# EAGLE design io_module (EAGLE 6.3)
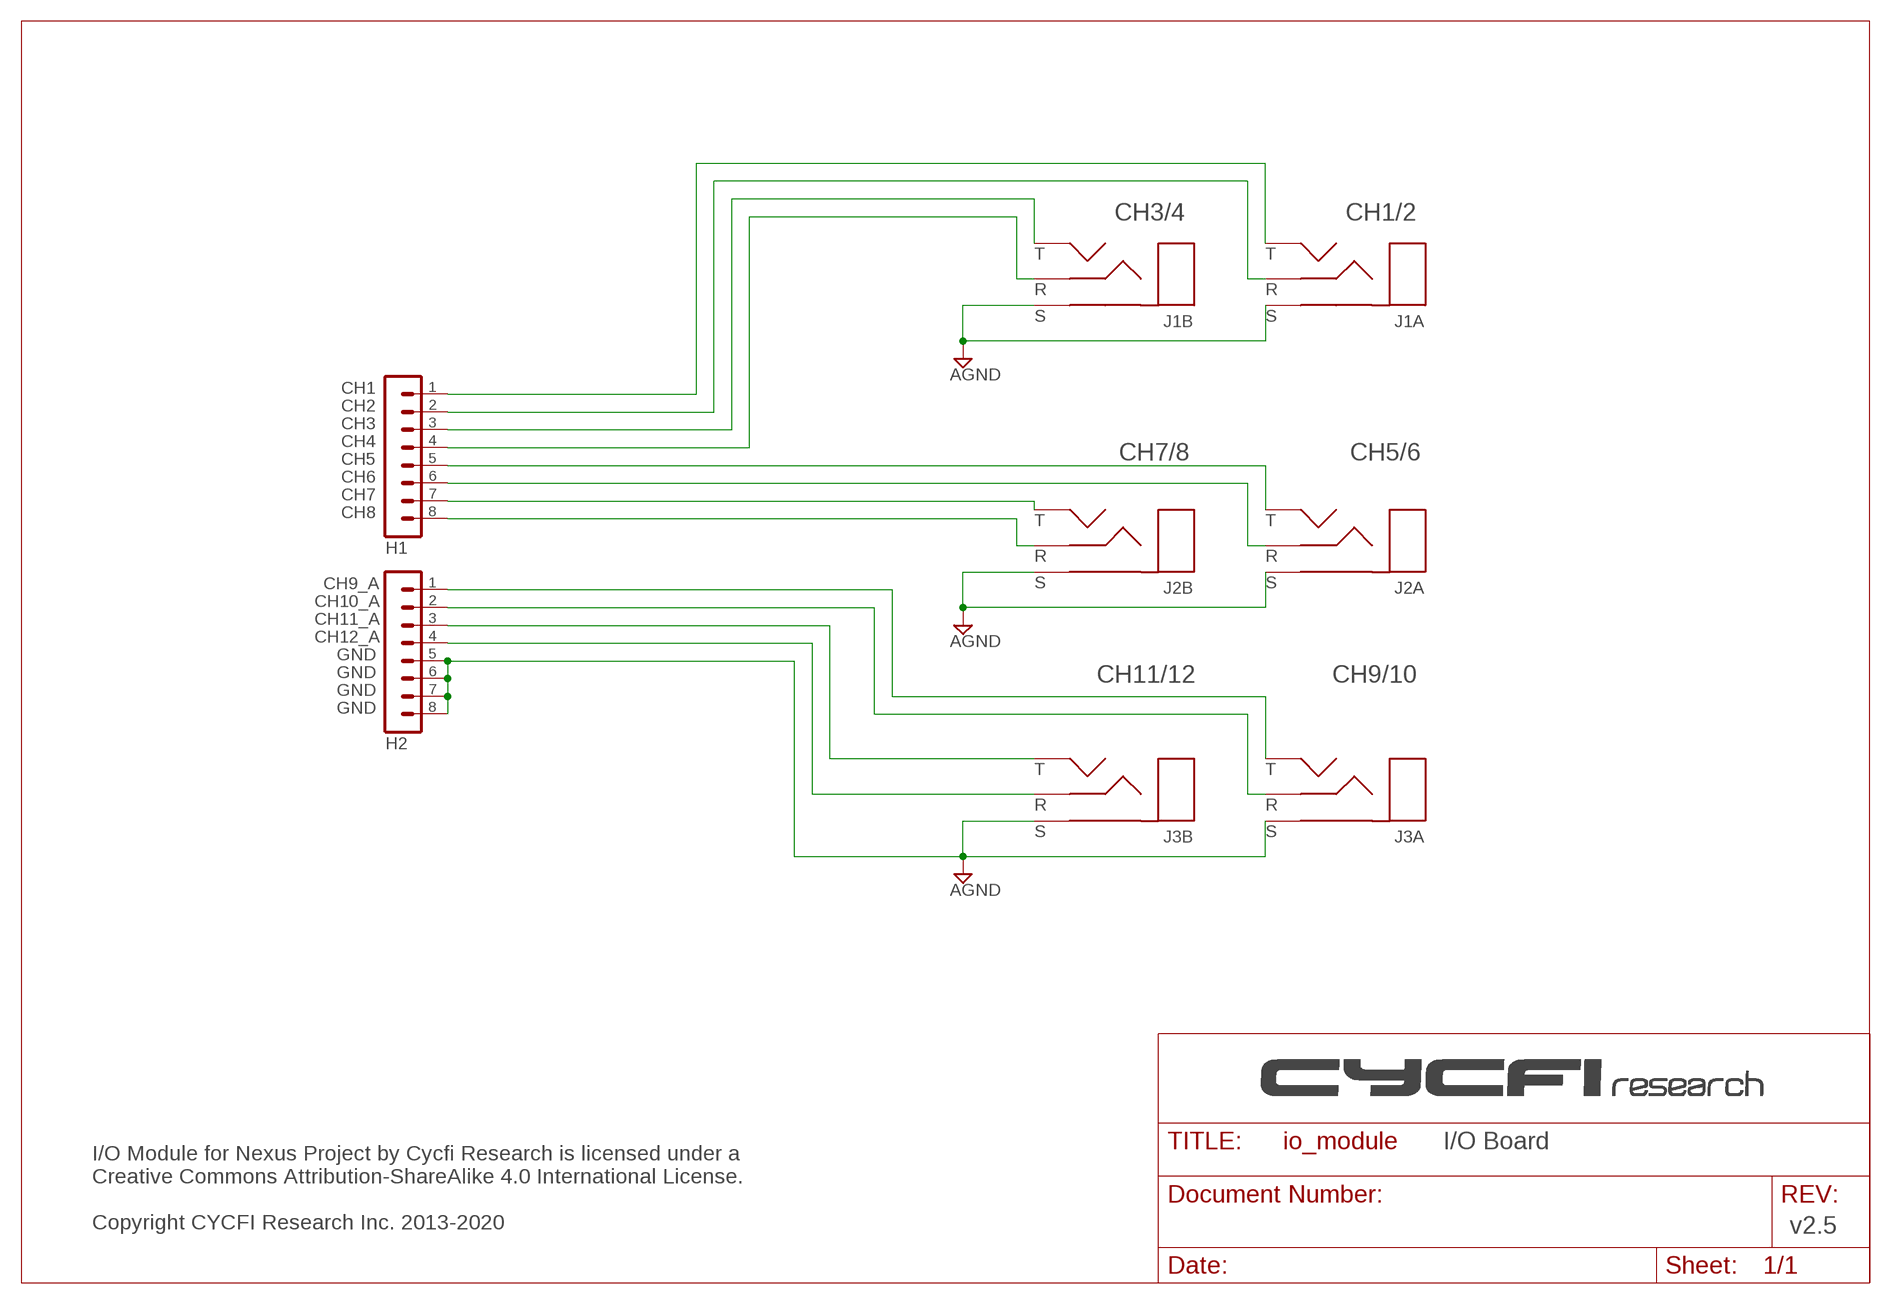
[diagram p0: schematic, sheet 1]

## Parts
H1  MA08-1  [MA08-1]
H2  MA08-1  [MA08-1]
J1  ZHEJINAG_CK_STSJACKS  [ZHEJINAG_CK_6.35]
J2  ZHEJINAG_CK_STSJACKS  [ZHEJINAG_CK_6.35]
J3  ZHEJINAG_CK_STSJACKS  [ZHEJINAG_CK_6.35]

## Nets
GND: H2.5 H2.6 H2.7 H2.8 J1.2S(S) J1.S J2.2S(S) J2.S J3.2S(S) J3.S ; supply symbol labelled AGND
N$1: H1.1 J1.2T(T)
N$3: H1.3 J1.T
N$4: H1.4 J1.R
N$5: H1.5 J2.2T(T)
N$6: H1.6 J2.2R(R)
N$7: H1.7 J2.T
N$8: H1.8 J2.R
N$9: H2.1 J3.2T(T)
N$10: H2.2 J3.2R(R)
N$11: H2.3 J3.T
N$12: H2.4 J3.R
N$13: H1.2 J1.2R(R)

## Notes on the sheet
- CH3/4 | CH1/2
- J1B | J1A
- CH1
- CH2
- CH3
- CH4
- CH5 | CH7/8 | CH5/6
- CH6
- CH7
- CH8
- CH9_A | J2B | J2A
- CH10_A
- CH11_A
- CH12_A
- CH11/12 | CH9/10
- J3B | J3A
- I/O Board
- I/O Module for Nexus Project by Cycfi Research is licensed under a 
  Creative Commons Attribution-ShareAlike 4.0 International License. 
  
  Copyright CYCFI Research Inc. 2013-2020
- v2.5

## Library data of the parts
H1 H2 = con-lstb:MA08-1: PIN HEADER; OC_FARNELL: unknown; OC_NEWARK: unknown
J1-J3 = CYCFI_Jack:ZHEJINAG_CK_STSJACKS

## Board
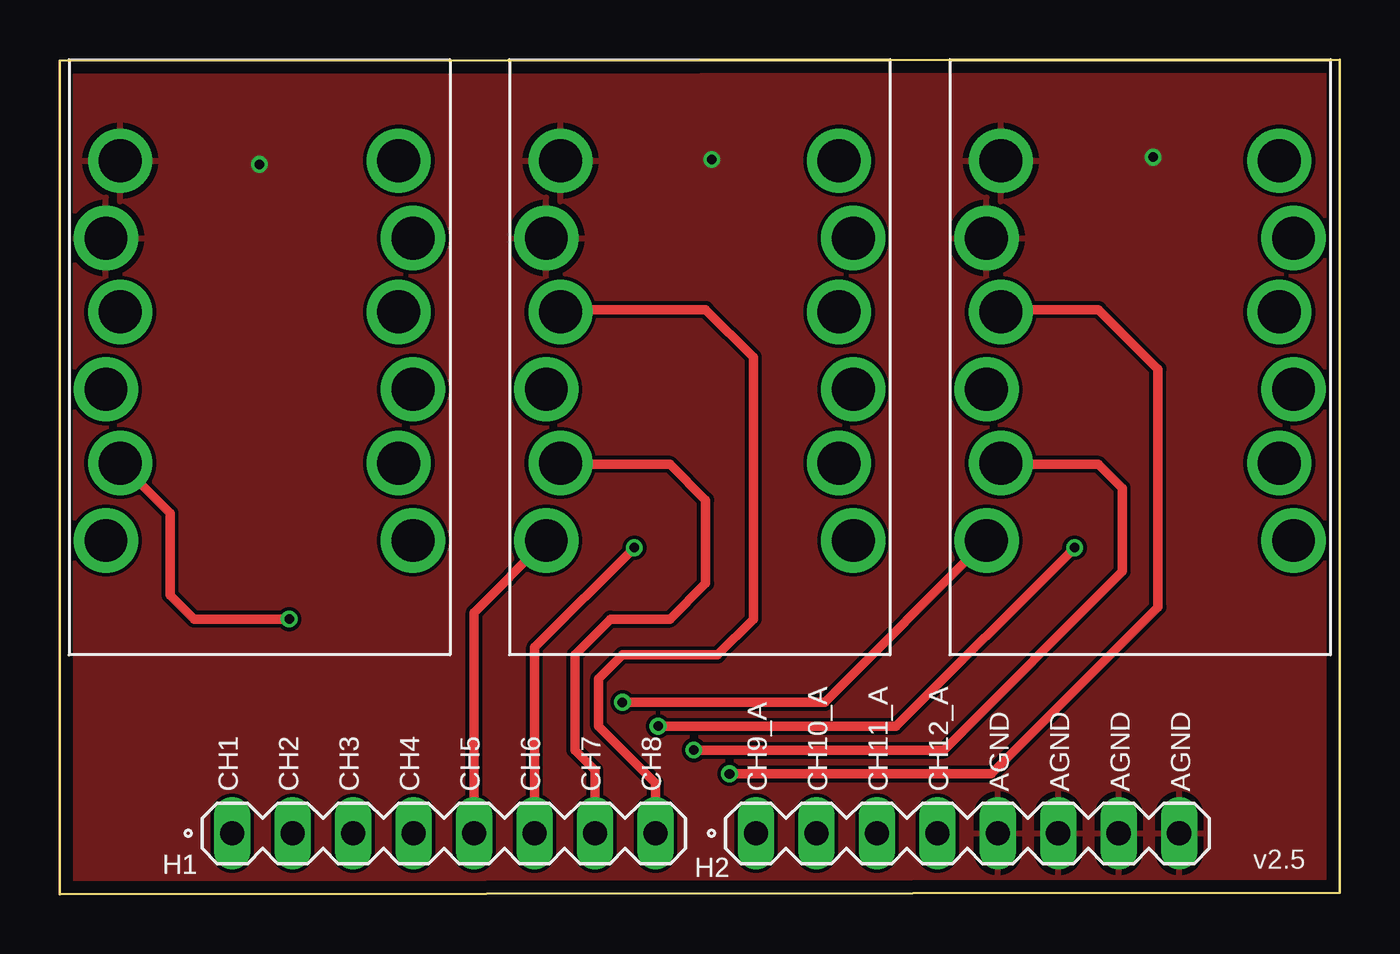
[diagram p1: board, top side]
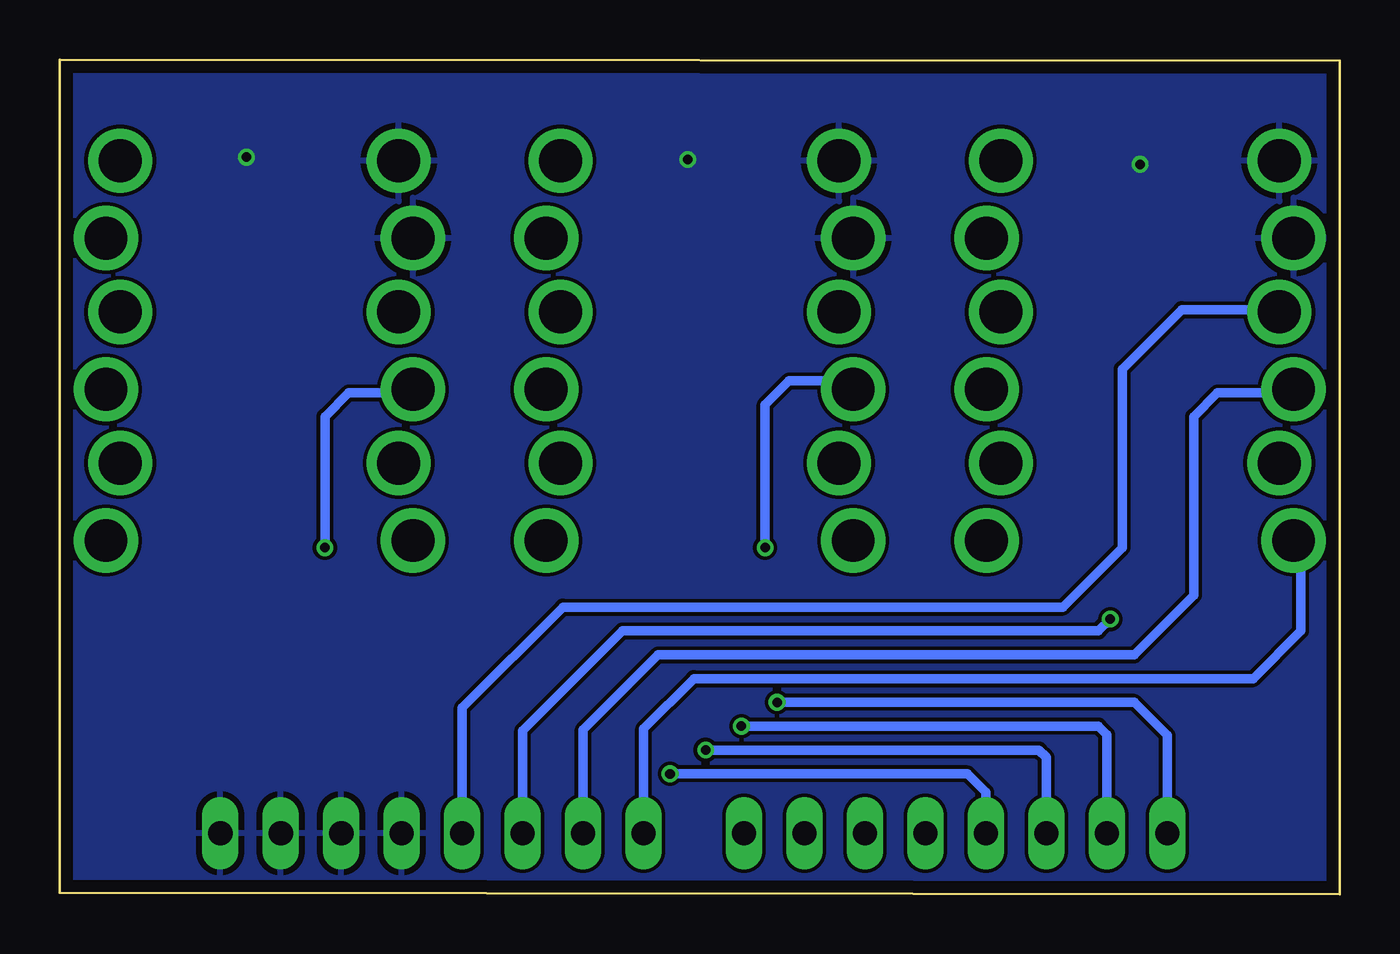
[diagram p2: board, bottom side, seen from below]

Size 53.8 x 35.05 mm. Coordinates in mm from the lower left corner, seen from the top.
Outline: 0,0 53.8,0.05 53.8,35.05 0,35 0,0
Copper layers (1*16): Top 0.035mm / dielectric 1.6mm / Bottom 0.035mm
Design rules "Elecrow_2-layer_PCB_eagle_rule": minimum track width 6mil, minimum drill 12mil, track to track 6mil, track to pad 8mil, pad to pad 12mil, via to via 12mil, smd to smd 0mil, copper to edge 20mil, drill to drill 10mil, minimum pad ring 6mil, minimum via ring 6mil, stop-mask expansion 0mil, vias tented up to drill 100mil, thermal gap 10mil

### Footprints (pad centres in the part's own frame; a part is rotated, then mirrored left to right if it is on the bottom)
MA08-1 = drill 1.016 long: 1 -8.89,0; 2 -6.35,0; 3 -3.81,0; 4 -1.27,0; 5 1.27,0; 6 3.81,0; 7 6.35,0; 8 8.89,0
ZHEJINAG_CK_6.35 = drill 1.8: 2R -13.85,6.45; 2RS -13.85,-6.45; 2S -7.5,6.45; 2SS -7.5,-6.45; 2T -20.2,6.45; 2TS -20.2,-6.45; R -10.6,5.85; RS -10.6,-5.85; S -4.25,5.85; SS -4.25,-5.85; T -16.95,5.85; TS -16.95,-5.85

### Placement (x,y rotation side)
H1  16.15,2.55 0 top
H2  38.15,2.55 0 top
J1  45.4,35.05 90 top
J2  26.9,35.05 90 top
J3  8.4,35.05 90 top

### Tracks (layer width: path | path; a pad name or v marks a point on that pad's centre or on a via)
GND  (via drill 0.4)
  other vias: 8.4,30.65 27.4,30.85 45.95,30.95
  pour Top: 0,35.05 0,0.05 53.8,0.05 53.8,35.05
  pour Bottom: 0,35.05 0,0.05 53.8,0.05 53.8,35.05
N$1  (via drill 0.4)
  Top 0.406: v23.65,8.05 32.15,8.05 J1.2T
  Bottom 0.406: H1.1 7.26,6.66 8.65,8.05 v23.65,8.05
N$3  (via drill 0.4)
  Top 0.406: v26.65,6.05 37.15,6.05 44.65,13.55 44.65,17.05 43.65,18.05 39.6,18.05 J1.T
  Bottom 0.406: H1.3 12.34,5.74 12.65,6.05 v26.65,6.05
N$4  (via drill 0.4)
  Top 0.406: v28.15,5.05 39.15,5.05 46.15,12.05 46.15,22.05 43.65,24.55 39.65,24.55 J1.R
  Bottom 0.406: H1.4 14.88,4.28 15.65,5.05 v28.15,5.05
N$5
  Top 0.406: H1.5 17.42,11.82 J2.2T
N$6  (via drill 0.4)
  Top 0.406: H1.6 19.96,10.36 v24.15,14.55
  Bottom 0.406: v24.15,14.55 24.15,20.55 23.15,21.55 20.8,21.55 J2.2R
N$7
  Top 0.406: H1.7 22.5,5.2 21.65,6.05 21.65,10.05 23.15,11.55 25.65,11.55 27.15,13.05 27.15,16.55 25.65,18.05 21.1,18.05 J2.T
N$8
  Top 0.406: H1.8 25.04,4.66 22.65,7.05 22.65,9.05 23.65,10.05 27.65,10.05 29.15,11.55 29.15,22.55 27.15,24.55 21.15,24.55 J2.R
N$9
  Bottom 0.406: H2.1 29.26,6.94 27.15,9.05 3.65,9.05 1.65,11.05 1.65,14.55 J3.2T
N$10
  Bottom 0.406: H2.2 31.8,6.9 28.65,10.05 8.65,10.05 6.15,12.55 6.15,20.05 5.15,21.05 2.1,21.05 J3.2R
N$11  (via drill 0.4)
  Top 0.406: v9.65,11.55 5.65,11.55 4.65,12.55 4.65,16 J3.T
  Bottom 0.406: H2.3 34.34,6.86 30.15,11.05 10.15,11.05 v9.65,11.55
N$12
  Bottom 0.406: H2.4 36.88,7.82 32.65,12.05 11.65,12.05 9.15,14.55 9.15,22.05 6.65,24.55 2.65,24.55 J3.R
N$13  (via drill 0.4)
  Top 0.406: v25.15,7.05 35.15,7.05 v42.65,14.55
  Bottom 0.406: H1.2 9.8,6.7 10.15,7.05 v25.15,7.05 | v42.65,14.55 42.65,20.05 41.65,21.05 39.1,21.05 J1.2R

### Text on the board
tNames: CH1 | CH2 | CH3 | CH4 | CH5 | CH6 | CH7 | CH8 | CH9_A | CH10_A | CH11_A | CH12_A | AGND | AGND | AGND | AGND | v2.5
_tNames: CH1 | CH2 | CH3 | CH4 | CH5 | CH6 | CH7 | CH8 | CH9_A | CH10_A | CH11_A | CH12_A | AGND | AGND | AGND | AGND | H1 | H2